# EAGLE design th_simple_ad (EAGLE 7.1.0)
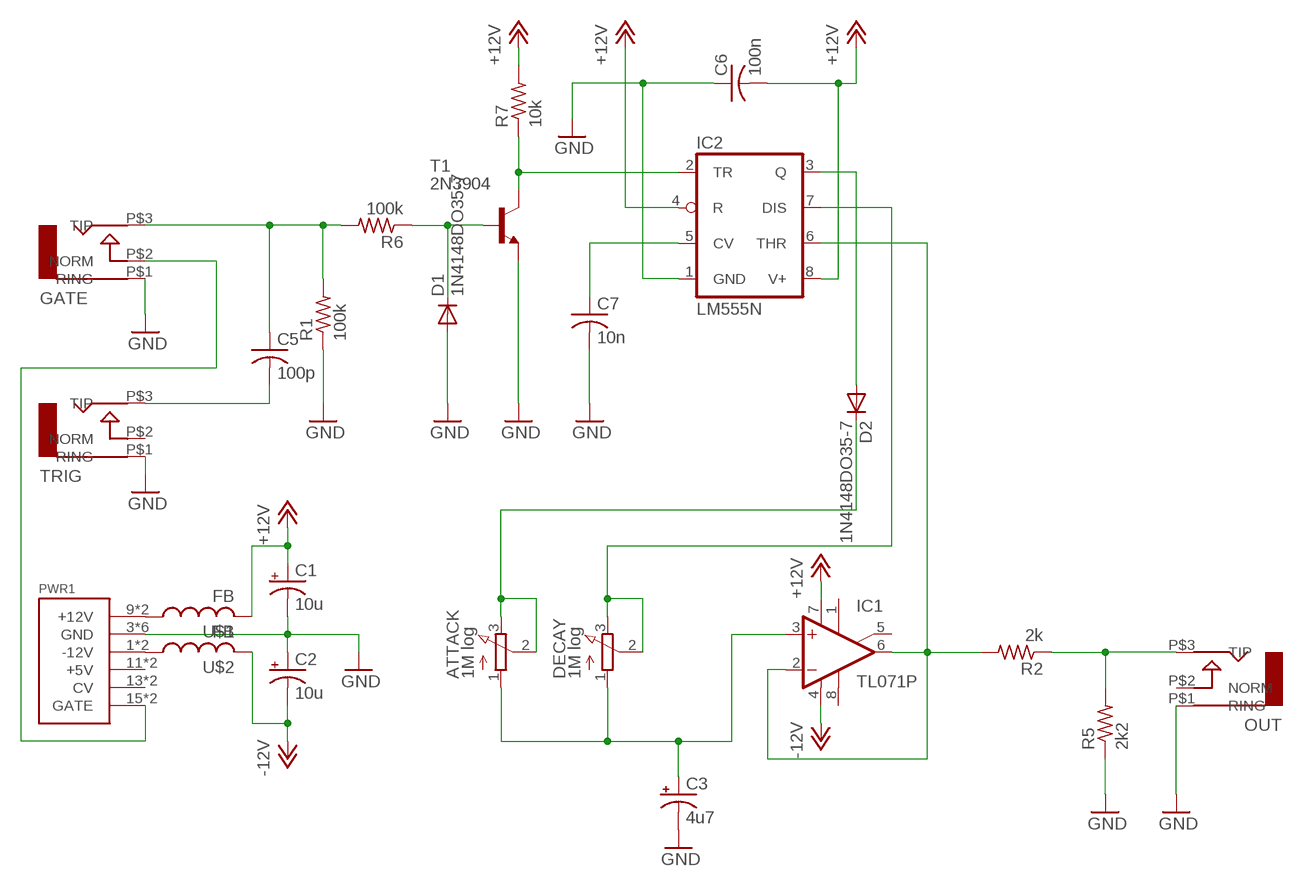
[diagram p0: schematic, sheet 1]

## Parts
ATTACK  1M log  3RP/1610N  [3RP/1610N]
C1  10u  CPOL-USB45181A  [B45181A]
C2  10u  CPOL-USB45181A  [B45181A]
C3  4u7  CPOL-USB45181A  [B45181A]
C5  100p  C-US050-024X044  [C050-024X044]
C6  100n  C-US050-024X044  [C050-024X044]
C7  10n  C-US050-024X044  [C050-024X044]
D1  1N4148DO35-7  [DO35-7]
D2  1N4148DO35-7  [DO35-7]
DECAY  1M log  3RP/1610N  [3RP/1610N]
GATE  AUDIO-JACK  [ERTHENVAR-JACK-90DEG]
IC1  TL071P  [DIL08]
IC2  LM555N  [DIL08-ROUND]
OUT  AUDIO-JACK  [ERTHENVAR-JACK-90DEG]
PWR1  POWER  [POWER_16]
R1  100k  R-US_0207/10  [0207/10]
R2  2k  R-US_0207/10  [0207/10]
R5  2k2  R-US_0207/10  [0207/10]
R6  100k  R-US_0207/10  [0207/10]
R7  10k  R-US_0207/10  [0207/10]
T1  2N3904  [TO92]
TRIG  AUDIO-JACK  [ERTHENVAR-JACK-90DEG]
U$1  FB  [FB]
U$2  FB  [FB]

## Nets
+12V: C1.+ C6.2 IC1.7(V+) IC2.4(R) IC2.8(V+) R7.2 U$1.P$2
-12V: C2.- IC1.4(V-) U$2.P$2
GND: C1.- C2.+ C3.- C6.1 C7.2 D1.A GATE.P$1(RING) IC2.1(GND) OUT.P$1(RING) PWR1.3(GND) PWR1.4(GND) PWR1.5(GND) PWR1.6(GND) PWR1.7(GND) PWR1.8(GND) R1.1 R5.1 T1.3(E) TRIG.P$1(RING)
N$1: PWR1.9(+12V) PWR1.10(+12V) U$1.P$1
N$2: PWR1.1(-12V) PWR1.2(-12V) U$2.P$1
N$3: OUT.P$3(TIP) R2.1 R5.2
N$5: IC1.2(-IN) IC1.6(OUT) IC2.6(THR) R2.2
N$6: D1.C R6.1 T1.2(B)
N$7: IC2.2(TR) R7.1 T1.1(C)
N$8: D2.A IC2.3(Q)
N$9: ATTACK.2(S) ATTACK.3(E) D2.C
N$10: C7.1 IC2.5(CV)
N$11: DECAY.2(S) DECAY.3(E) IC2.7(DIS)
N$12: GATE.P$2(NORM) PWR1.15(GATE) PWR1.16(GATE)
N$13: C5.2 TRIG.P$3(TIP)
N$14: C5.1 GATE.P$3(TIP) R1.2 R6.2
N$16: ATTACK.1(A) C3.+ DECAY.1(A) IC1.3(+IN)
Unconnected: IC1.1(ON1) IC1.5(ON2) IC1.8(OPT) OUT.P$2(NORM) PWR1.11(+5V) PWR1.12(+5V) PWR1.13(CV) PWR1.14(CV) TRIG.P$2(NORM)

## Library data of the parts
ATTACK DECAY = pot:3RP/1610N: 16mm Potentiometer one level Source: http://www.alphapotentiometers.net/html/16mm_pot_2.html
C1-C3 = rcl:CPOL-US: POLARIZED CAPACITOR, American symbol
C5-C7 = rcl:C-US: CAPACITOR, American symbol
D1 D2 = diode:1N4148: DIODE high speed (Philips)
GATE OUT TRIG = erthenvar:AUDIO-JACK: Switching Mono 3.5mm Audio Jack from Erthenvar.
IC1 = linear:TL071: OP AMP
IC2 = adafruit:*555: TIMER Changed DIP package to have round (not oval) pin pads http://www.ladyada.net/library/pcb/eaglelibrary.html
PWR1 = eurorack:POWER
R1 R2 R5-R7 = rcl:R-US_: RESISTOR, American symbol
T1 = transistor:2N3904: NPN TRANSISTOR
U$1 U$2 = adafruit:FB: Ferrite bead Digikey #P9821BK-ND

## Board
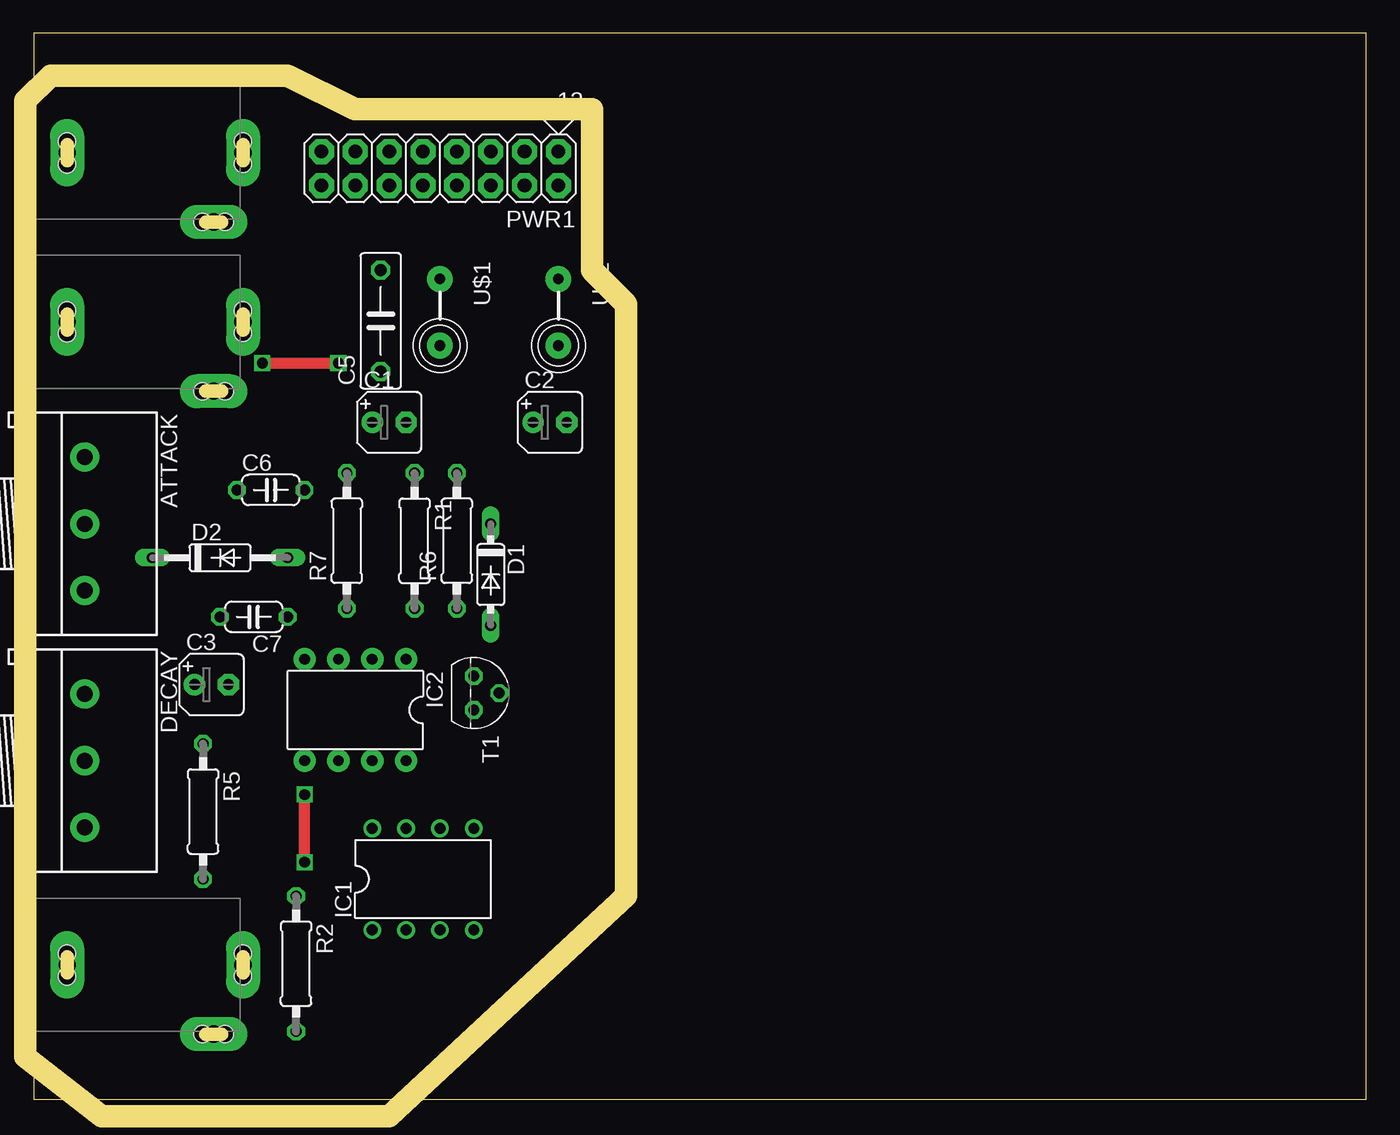
[diagram p1: board, top side]
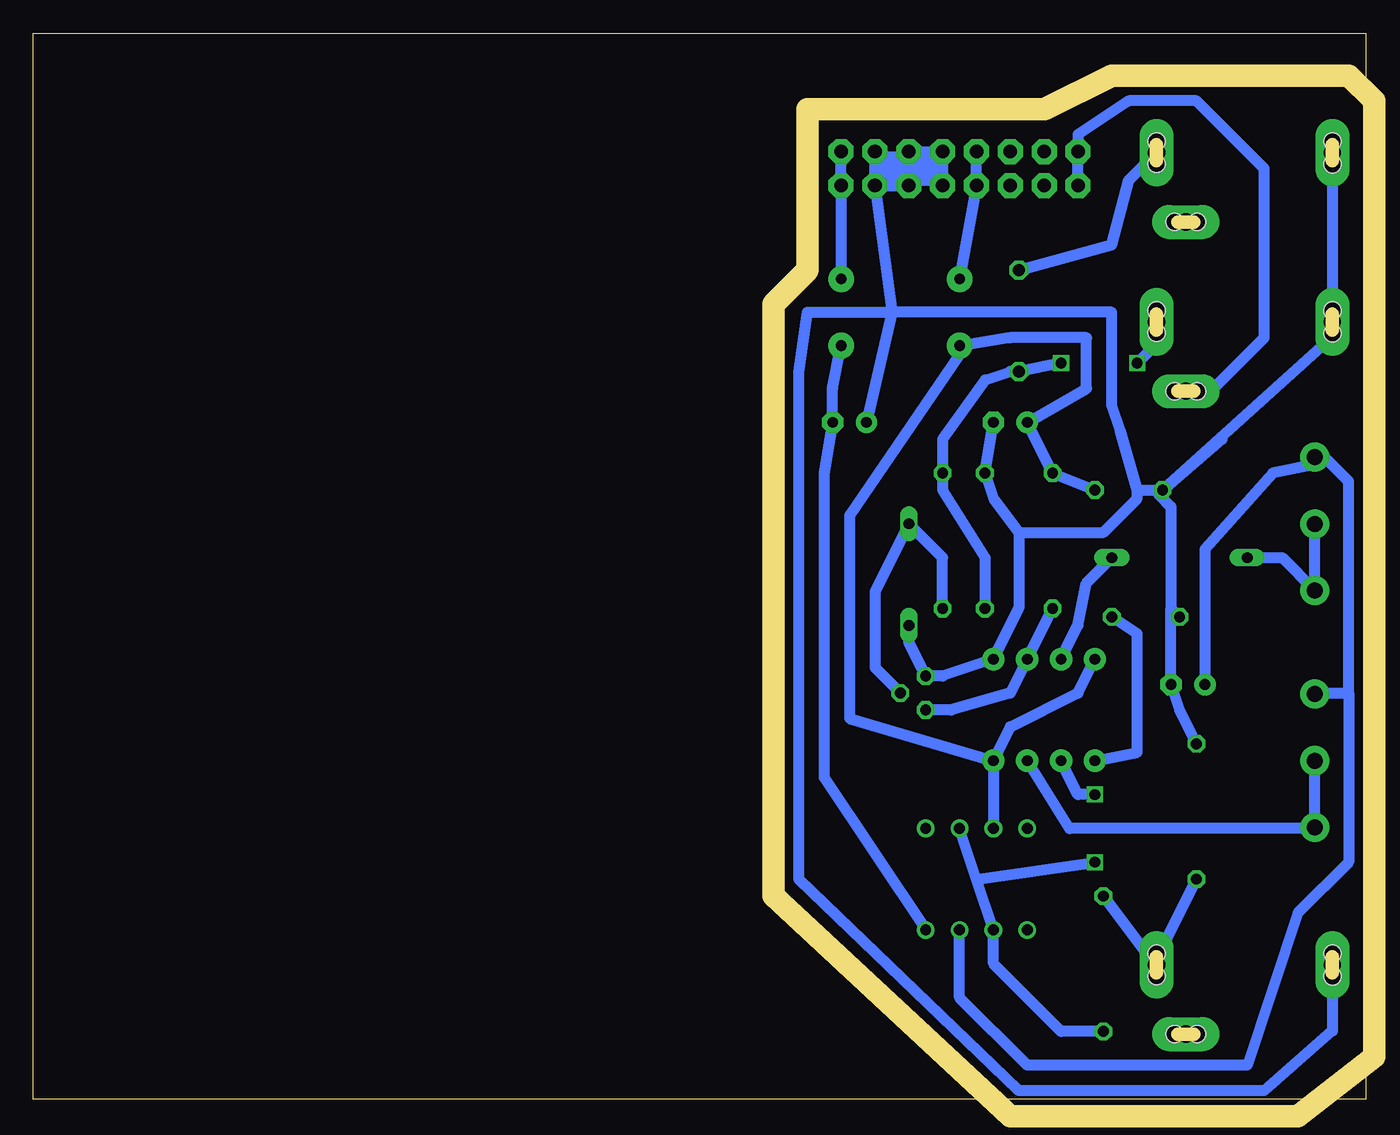
[diagram p2: board, bottom side, seen from below]

Size 100 x 80 mm. Coordinates in mm from the lower left corner, seen from the top.
Outline: 0,0 100,0 100,80 0,80 0,0
Copper layers (1*16): Top 0.035mm / dielectric 1.5mm / Bottom 0.035mm
Design rules "default *": minimum track width 32mil, minimum drill 32mil, track to track 16mil, track to pad 16mil, pad to pad 16mil, via to via 16mil, smd to smd 8mil, copper to edge 0mil, drill to drill 16mil, minimum pad ring 10mil, minimum via ring 8mil, stop-mask expansion 4mil, vias tented up to drill 0mil, thermal gap 10mil
Milling: 11 lines

### Footprints (pad centres in the part's own frame; a part is rotated, then mirrored left to right if it is on the bottom)
3RP/1610N = drill 1.2 pad 2.184: 1 -5,0; 2 0,0; 3 5,0
B45181A = drill 0.813 pad 1.6: + -1.27,0 | drill 0.813 pad 1.6 octagon: - 1.27,0
C075-032X103 = drill 0.914 octagon: 1 -3.81,0; 2 3.81,0
C050-024X044 = drill 0.813 octagon: 1 -2.54,0; 2 2.54,0
DO35-7 = drill 0.813 long: A 3.81,0; C -3.81,0
DO35-10 = drill 0.813 long: A 5.08,0; C -5.08,0
ERTHENVAR-JACK-90DEG = drill 1.3 pad 2.54 long: P$1 5,-2.5; P$2 -0.2,-13.5; P$3 5,-15.7 | hole 1.3: 5.842,-2.489; 4.14,-2.489; -0.203,-12.649; -0.203,-14.351; 5.842,-15.697; 4.166,-15.697
DIL08 = drill 0.813 pad 1.27: 1 -3.81,-3.81; 2 -1.27,-3.81; 3 1.27,-3.81; 4 3.81,-3.81; 5 3.81,3.81; 6 1.27,3.81; 7 -1.27,3.81; 8 -3.81,3.81
DIL08-ROUND = drill 0.813 pad 1.676: 1 -3.81,-3.81; 2 -1.27,-3.81; 3 1.27,-3.81; 4 3.81,-3.81; 5 3.81,3.81; 6 1.27,3.81; 7 -1.27,3.81; 8 -3.81,3.81
POWER_16 = drill 1.016 pad 1.88 octagon: 1 -6.35,-1.27; 2 -6.35,1.27; 3 -3.81,-1.27; 4 -3.81,1.27; 5 -1.27,-1.27; 6 -1.27,1.27; 7 1.27,-1.27; 8 1.27,1.27; 9 3.81,-1.27; 10 3.81,1.27; 11 6.35,-1.27; 12 6.35,1.27; 13 8.89,-1.27; 14 8.89,1.27; 15 11.43,-1.27; 16 11.43,1.27
0207/10 = drill 0.813 octagon: 1 -5.08,0; 2 5.08,0
TO92 = drill 0.813 octagon: 1 1.27,0; 2 0,1.905; 3 -1.27,0
FB = drill 0.8 pad 1.93: P$1 -2.5,0; P$2 2.5,0

### Placement (x,y rotation side)
ATTACK  3.81,43.18 270 top
C1  26.67,50.8 0 top
C2  38.73,50.8 0 top
C3  13.34,31.11 0 top
C5  100p  [C075-032X103]  26.04,58.42 90 top
C6  17.78,45.72 0 top
C7  16.51,36.2 180 top
D1  34.29,39.37 270 top
D2  1N4148DO35-10  [DO35-10]  13.97,40.64 0 top
DECAY  3.81,25.4 270 top
GATE  0,53.34 90 top
IC1  29.21,16.51 0 top
IC2  24.13,29.21 180 top
OUT  0,5.08 90 top
PWR1  33.02,69.85 180 top
R1  28.57,41.91 270 top
R2  19.68,10.16 270 top
R5  12.7,21.59 270 top
R6  31.75,41.91 90 top
R7  23.5,41.91 90 top
T1  33.02,30.48 270 top
TRIG  0,66.04 90 top
U$1  30.48,59.05 270 top
U$2  39.37,59.05 270 top

### Tracks (layer width: path | path; a pad name or v marks a point on that pad's centre or on a via)
+12V
  Bottom 0.813: IC2.8 IC1.7 | IC2.8 26.67,27.94 21.59,30.48 IC2.4 | C6.2 R7.2 C1.+ 20.95,53.34 20.95,57.15 26.67,57.15 30.48,56.52 U$1.P$2 30.48,55.88 38.73,43.81 38.73,28.57 IC2.8
-12V
  Bottom 0.813: IC1.4 40.64,24.13 40.64,46.99 C2.- 40.01,53.34 U$2.P$2
GND
  Bottom 0.813: PWR1.8 PWR1.7 PWR1.5 PWR1.6 PWR1.4 | 35.56,59.05 C2.+ | PWR1.4 35.56,59.05 | PWR1.4 PWR1.3 | 14.61,36.83 C3.- 13.97,29.21 R5.1 | 14.61,36.83 C7.2 | 17.14,45.72 C6.1 10.79,49.53 15.56,45.4 | 17.14,45.72 17.14,45.09 19.68,42.55 26.04,42.55 | C1.- R1.1 27.94,45.09 26.04,42.55 | 26.04,42.55 26.04,36.83 IC2.1 31.75,31.75 T1.3 34.29,34.29 D1.A | 14.61,36.83 14.61,44.45 15.56,45.4 | 35.56,59.05 19.05,59.05 19.05,52.07 18.41,50.16 17.14,45.72 | TRIG.P$1 GATE.P$1 2.5,57.19 15.56,45.4 | OUT.P$1 2.5,5.12 7.62,0.64 26.04,0.64 42.55,16.51 42.55,54.61 41.91,59.05 35.56,59.05
N$1
  Bottom 0.813: PWR1.9 PWR1.10 U$1.P$1
N$2
  Bottom 0.813: PWR1.1 PWR1.2 U$2.P$1
N$3
  Bottom 0.813: 15.88,10.16 R5.2 | R2.1 15.88,10.16 | 15.88,10.16 15.78,10.16 OUT.P$3
N$5  (via drill 0.8)
  Top 0.813: v20.32,17.78 v20.32,22.86
  Bottom 0.813: R2.2 22.86,5.08 27.94,10.16 IC1.2 29.21,16.51 | 29.21,16.51 IC1.6 | IC2.6 21.59,22.86 v20.32,22.86 | 29.21,16.51 v20.32,17.78
N$6
  Bottom 0.813: T1.2 36.83,32.38 36.83,38.1 D1.C 31.75,40.64 R6.1
N$7
  Bottom 0.813: R7.1 IC2.2 26.67,30.48 31.11,29.21 T1.1
N$8
  Bottom 0.813: IC2.3 21.59,35.56 20.95,38.73 D2.A
N$9
  Bottom 0.813: ATTACK.2 ATTACK.3 6.27,40.64 D2.C
N$10
  Bottom 0.813: C7.1 17.14,34.92 17.14,26.04 IC2.5
N$11
  Bottom 0.813: IC2.7 22.23,20.32 3.81,20.32 DECAY.3 DECAY.2
N$12
  Bottom 0.813: PWR1.16 PWR1.15 21.59,72.39 17.78,74.93 12.7,74.93 7.62,69.85 7.62,57.15 11.63,53.14 GATE.P$2
N$13
  Bottom 0.813: C5.2 19.05,64.14 17.78,68.96 TRIG.P$3
N$14  (via drill 0.8)
  Top 0.813: v17.14,55.24 v22.86,55.24
  Bottom 0.813: GATE.P$3 15.7,56.69 v17.14,55.24 | v22.86,55.24 C5.1 26.67,54.61 28.57,53.98 31.75,49.53 R6.2 31.75,45.72 28.57,40.64 R1.2
N$16
  Bottom 0.813: C3.+ 12.06,41.27 6.99,46.99 3.81,47.62 | 3.81,47.62 3.17,48.26 1.27,46.35 1.27,30.48 | 3.81,47.62 ATTACK.1 | IC1.3 30.48,7.62 25.4,2.54 8.89,2.54 5.08,13.97 1.27,17.78 1.27,30.48 | 1.27,30.48 3.81,30.48 DECAY.1
(copper drawn outside any net)
  shapes: Bottom area x1